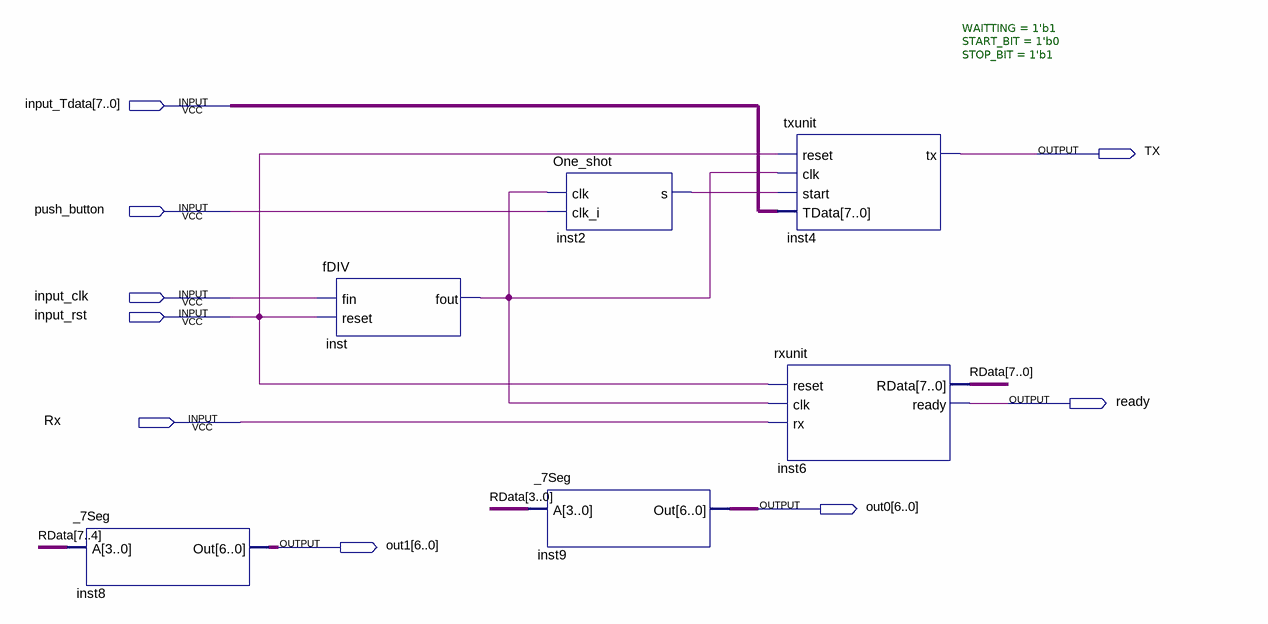
[diagram p0: schematic sheet]
// Quartus schematic RS232.bdf as structural Verilog: 6 symbols, 9 pins
module RS232 (
  input  [7:0] input_Tdata,
  input  push_button,
  input  input_clk,
  input  input_rst,
  input  Rx,
  output TX,
  output ready,
  output [6:0] out0,
  output [6:0] out1
);

  wire inst2_s, inst_fout;
  wire [7:0] RData;

  _7Seg inst8 (.A(RData[7:4]), .Out(out1));
  fDIV inst (.fin(input_clk), .reset(input_rst), .fout(inst_fout));
  One_shot inst2 (.clk(inst_fout), .clk_i(push_button), .s(inst2_s));
  _7Seg inst9 (.A(RData[3:0]), .Out(out0));
  txunit #(.WAITTING(1'b1), .START_BIT(1'b0), .STOP_BIT(1'b1)) inst4 (
    .reset(input_rst), .clk(inst_fout), .start(inst2_s), .TData(input_Tdata), .tx(TX));
  rxunit inst6 (.reset(input_rst), .clk(inst_fout), .rx(Rx), .RData(RData), .ready(ready));
endmodule
